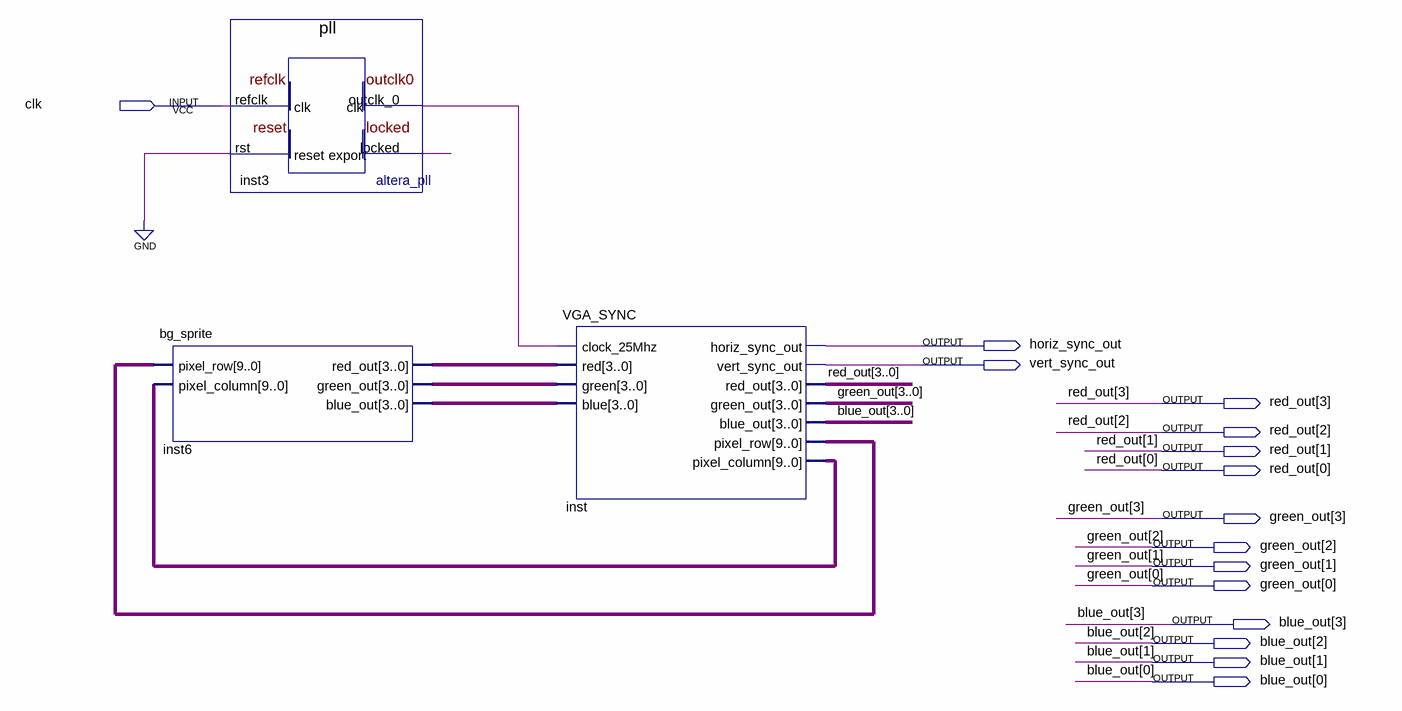
[diagram p0: schematic sheet]
// Quartus schematic vga-withback.bdf as structural Verilog: 3 symbols, 15 pins
module \vga-withback  (
  input  clk,
  output horiz_sync_out,
  output vert_sync_out,
  output [3:0] red_out,
  output [3:0] green_out,
  output [3:0] blue_out
);

  wire inst3_locked, inst3_outclk_0;
  wire [3:0] inst6_blue_out, inst6_green_out, inst6_red_out;
  wire [9:0] inst_pixel_column, inst_pixel_row;

  bg_sprite inst6 (
    .pixel_row(inst_pixel_row), .pixel_column(inst_pixel_column), .red_out(inst6_red_out),
    .green_out(inst6_green_out), .blue_out(inst6_blue_out));
  pll inst3 (.refclk(clk), .rst(1'b0), .outclk_0(inst3_outclk_0), .locked(inst3_locked));
  VGA_SYNC inst (
    .clock_25Mhz(inst3_outclk_0), .red(inst6_red_out), .green(inst6_green_out), .blue(inst6_blue_out),
    .horiz_sync_out(horiz_sync_out), .vert_sync_out(vert_sync_out), .red_out(red_out), .green_out(green_out),
    .blue_out(blue_out), .pixel_row(inst_pixel_row), .pixel_column(inst_pixel_column));
endmodule
